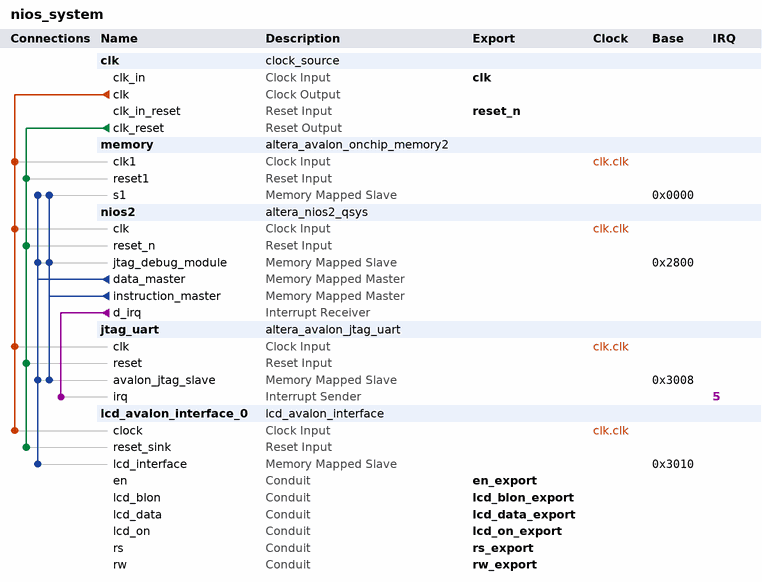
[diagram p0: system contents]
# Platform Designer (Qsys) system nios_system, Cyclone II EP2C35F672C6
# Parameters at their usual value, and those the tool derives, are not listed.
package require -exact qsys 13.0
create_system nios_system
set_project_property DEVICE_FAMILY {Cyclone II}
set_project_property DEVICE EP2C35F672C6

add_instance clk clock_source 13.0
set_instance_parameter_value clk clockFrequency 50000000

add_instance memory altera_avalon_onchip_memory2 13.0.1.99.2
set_instance_parameter_value memory dataWidth 32
set_instance_parameter_value memory dualPort false
set_instance_parameter_value memory initMemContent true
set_instance_parameter_value memory initializationFileName onchip_mem.hex
set_instance_parameter_value memory memorySize 8192

add_instance nios2 altera_nios2_qsys 13.0
set_instance_parameter_value nios2 resetSlave memory.s1
set_instance_parameter_value nios2 mmu_TLBMissExcSlave None
set_instance_parameter_value nios2 exceptionSlave memory.s1
set_instance_parameter_value nios2 breakSlave nios2.jtag_debug_module
set_instance_parameter_value nios2 impl Tiny
set_instance_parameter_value nios2 icache_size 4096

add_instance jtag_uart altera_avalon_jtag_uart 13.0.1.99.2
set_instance_parameter_value jtag_uart simInteractiveOptions NO_INTERACTIVE_WINDOWS

add_instance lcd_avalon_interface_0 lcd_avalon_interface 1.0

# connections
add_connection clk.clk jtag_uart.clk clock
add_connection clk.clk lcd_avalon_interface_0.clock clock
add_connection clk.clk memory.clk1 clock
add_connection clk.clk nios2.clk clock
add_connection clk.clk_reset jtag_uart.reset reset
add_connection clk.clk_reset lcd_avalon_interface_0.reset_sink reset
add_connection clk.clk_reset memory.reset1 reset
add_connection clk.clk_reset nios2.reset_n reset
add_connection nios2.data_master jtag_uart.avalon_jtag_slave avalon
set_connection_parameter_value nios2.data_master/jtag_uart.avalon_jtag_slave baseAddress 0x3008
add_connection nios2.data_master lcd_avalon_interface_0.lcd_interface avalon
set_connection_parameter_value nios2.data_master/lcd_avalon_interface_0.lcd_interface baseAddress 0x3010
add_connection nios2.data_master memory.s1 avalon
set_connection_parameter_value nios2.data_master/memory.s1 baseAddress 0x0000
add_connection nios2.data_master nios2.jtag_debug_module avalon
set_connection_parameter_value nios2.data_master/nios2.jtag_debug_module baseAddress 0x2800
add_connection nios2.instruction_master jtag_uart.avalon_jtag_slave avalon
set_connection_parameter_value nios2.instruction_master/jtag_uart.avalon_jtag_slave baseAddress 0x3008
add_connection nios2.instruction_master memory.s1 avalon
set_connection_parameter_value nios2.instruction_master/memory.s1 baseAddress 0x0000
add_connection nios2.instruction_master nios2.jtag_debug_module avalon
set_connection_parameter_value nios2.instruction_master/nios2.jtag_debug_module baseAddress 0x2800
add_connection nios2.d_irq jtag_uart.irq interrupt
set_connection_parameter_value nios2.d_irq/jtag_uart.irq irqNumber 5

# exported interfaces
add_interface clk clock sink
set_interface_property clk EXPORT_OF clk.clk_in
add_interface reset_n reset sink
set_interface_property reset_n EXPORT_OF clk.clk_in_reset
add_interface rs_export conduit end
set_interface_property rs_export EXPORT_OF lcd_avalon_interface_0.rs
add_interface en_export conduit end
set_interface_property en_export EXPORT_OF lcd_avalon_interface_0.en
add_interface rw_export conduit end
set_interface_property rw_export EXPORT_OF lcd_avalon_interface_0.rw
add_interface lcd_data_export conduit end
set_interface_property lcd_data_export EXPORT_OF lcd_avalon_interface_0.lcd_data
add_interface lcd_on_export conduit end
set_interface_property lcd_on_export EXPORT_OF lcd_avalon_interface_0.lcd_on
add_interface lcd_blon_export conduit end
set_interface_property lcd_blon_export EXPORT_OF lcd_avalon_interface_0.lcd_blon

set_interconnect_requirement {$system} qsys_mm.clockCrossingAdapter HANDSHAKE
set_interconnect_requirement {$system} qsys_mm.maxAdditionalLatency 1

save_system nios_system.qsys
